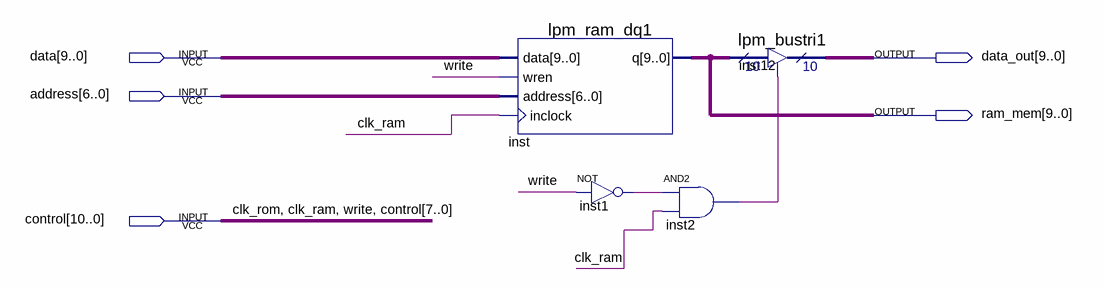
[diagram p0: schematic sheet]
// Quartus schematic ram.bdf as structural Verilog: 4 symbols, 5 pins
module ram (
  input  [9:0] data,
  input  [6:0] address,
  input  [10:0] control,
  output [9:0] data_out,
  output [9:0] ram_mem
);

  wire inst1_out, inst2_out;

  lpm_ram_dq1 inst (.data(data), .wren(control[8]), .address(address), .inclock(control[9]), .q(ram_mem));
  not inst1 (inst1_out, control[8]);
  and inst2 (inst2_out, inst1_out, control[9]);
  lpm_bustri1 inst12 (.enabledt(inst2_out), .data(ram_mem), .tridata(data_out));

  // Other names for the same wires on the sheet: clk_ram = control[9]; clk_rom = control[10]; write = control[8]
endmodule
